# Altium schematic sheet Shematic_servo_light.SchDoc
size A4; SheetNumber: 1; SheetTotal: 1
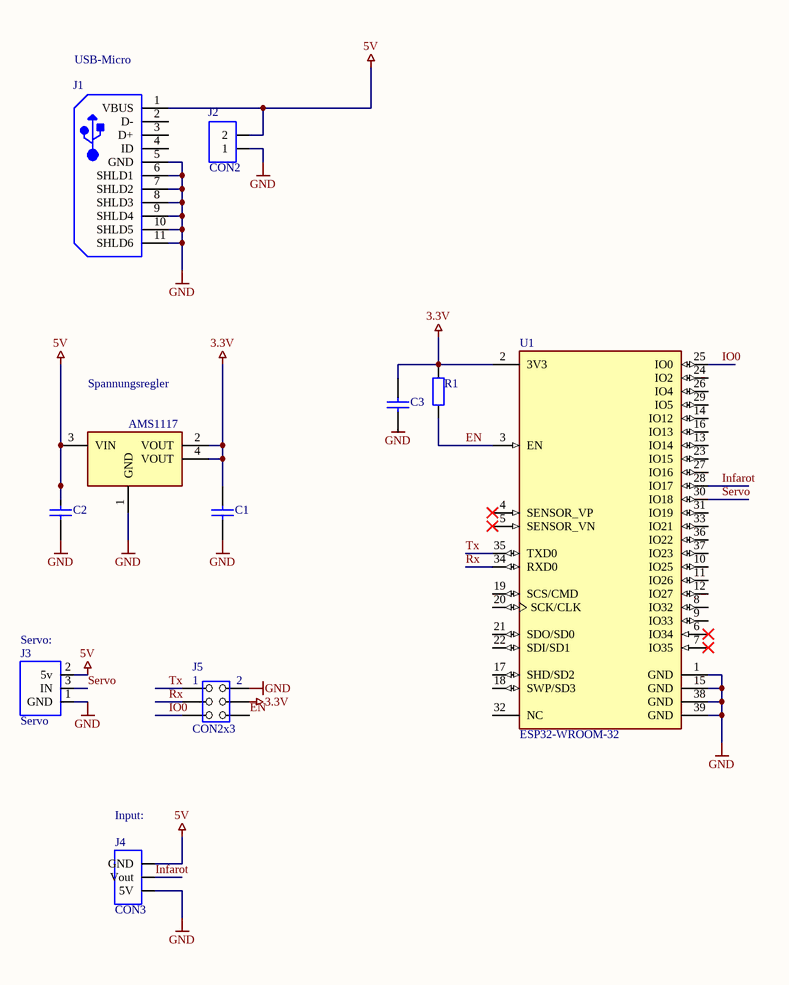
[diagram p0: Shematic_servo_light.SchDoc]

## Parts
C1  Cap Ceramic  [0805C]  (value not drawn)
C2  Cap Ceramic  [0805C]  (value not drawn)
C3  Cap Ceramic  [0805C]  (value not drawn)
J1  USB-Micro  [USB-MICRO-B_V - RZEP_CN]
J2  CON2  [SIP-2]
J3  Servo  [Sip-3]
J4  CON3  [Sip-3]
J5  CON2x3  [PFOSTEN_2x3]
R1  Resistor  [0805R]  (value not drawn)
U1  ESP32-WROOM-32  [MODULE_ESP32-WROOM-32]
U2  AMS1117  [FP-ams1117-IPC_A]

## Nets
3.3V: C1.2 C3.2 J5.4(3V3) R1.1 U1.2(3V3) U2.2(VOUT) U2.4(VOUT)
5V: C2.2 J1.1(VBUS) J2.2 J3.2(5v) J4.3(GND) U2.3(VIN)
GND: C1.1 C2.1 J1.5(GND) J1.6(SHLD1) J1.7(SHLD2) J1.8(SHLD3) J1.9(SHLD4) J1.10(SHLD5) J1.11(SHLD6) J2.1 J3.1(GND) J4.1(5V) J5.2(GND) U1.1(GND) U1.15(GND) U1.38(GND) U1.39(GND) U2.1(GND)
EN: J5.6(EN) R1.2 U1.3(EN)
Infarot: J4.2(Vout) U1.28(IO17)
IO0: J5.5(IO0) U1.25(IO0)
Rx: J5.3(Rx) U1.34(RXD0)
Servo: J3.3(IN) U1.30(IO18)
Tx: J5.1(Tx) U1.35(TXD0)

Not connected (* = marked no-connect by the designer): C3 1; J1 2(D-) 3(D+) 4(ID); U1 4(SENSOR_VP)* 5(SENSOR_VN)* 6(IO34)* 7(IO35)* 8(IO32) 9(IO33) 10(IO25) 11(IO26) 12(IO27) 13(IO14) 14(IO12) 16(IO13) 17(SHD/SD2) 18(SWP/SD3) 19(SCS/CMD) 20(SCK/CLK) 21(SDO/SD0) 22(SDI/SD1) 23(IO15) 24(IO2) 26(IO4) 27(IO16) 29(IO5) 31(IO19) 32(NC) 33(IO21) 36(IO22) 37(IO23)

## Notes on the sheet
- Spannungsregler
- (near J3) Servo:
- (near J4) Input:
- Labels drawn without touching a wire or pin: GND

## Library data of the parts
C1-C3 = Cap Ceramic: Kondensator
J1 = USB_CMP-2000-05610-1: Right Angle Female Type AB Micro USB Connector, 30 V, 1.8 A, -30 to 85 degC, RoHS, Tape and Reel; Number of Ports: 1Port; Current Rating: 1.8A; Brand: Molex; Connector Type: MicroUSBTypeABreceptacle; Number of Contacts: 5Contact; Voltage Rating: 30VAC; Color: Black; Product: MicroUSBTypeABConnectors; Package URL: http://www.molex.com/pdm_docs/sd/475890001_sd.pdf; Contact Plating: Gold; Datasheet URL: http://www.molex.com/webdocs/datasheets/pdf/en-us/0475890001_IO_CONNECTORS.pdf; Operating Temperature Range: -20Cto+85C; Termination Style: SMD/SMT; Mounting Angle: Right; Package Reference: 47589-0001; Gender: Female; Package Description: Micro USB Connector, Pitch 0.65 mm, 5 Positions, Body 7.5 x 5.6 mm; Mounting Technology: SurfaceMount; Contact Material: CopperAlloy; Packaging: Reel; RoHS: True; Standard: USB; Manufacturer URL: http://www.molex.com/; Manufacturer: Molex; Datasheet Version: 12/2016; Product Category: USBConnectors; Series: 47589
J2 = CON2: Stecker
J3 = Servo: Stecker
J4 = CON3: Stecker
J5 = CON2x3: Stecker
R1 = Resistor: Widerstand
U1 = ESP32-WROOM-32: Bluetooth, WiFi 802.11b/g/n, Bluetooth v4.2 +EDR, Class 1, 2 and 3 Transceiver Module 2.4GHz ~ 2.5GHz Antenna Not Included, U.FL Surface Mount; MF: Espressif Systems; Price: None; Availability: In Stock; MP: ESP32-WROOM-32; Package: Module Espressif Systems; SnapEDA_Link: https://www.snapeda.com/parts/ESP32-WROOM-32/Espressif+Systems/view-part/?ref=snap; Check_prices: https://www.snapeda.com/parts/ESP32-WROOM-32/Espressif+Systems/view-part/?ref=eda; Value: *; Purchase-URL: https://pricing.snapeda.com/search/part/ESP32-WROOM-32/?ref=eda